# EAGLE design atmega32U4 (EAGLE 6.4)
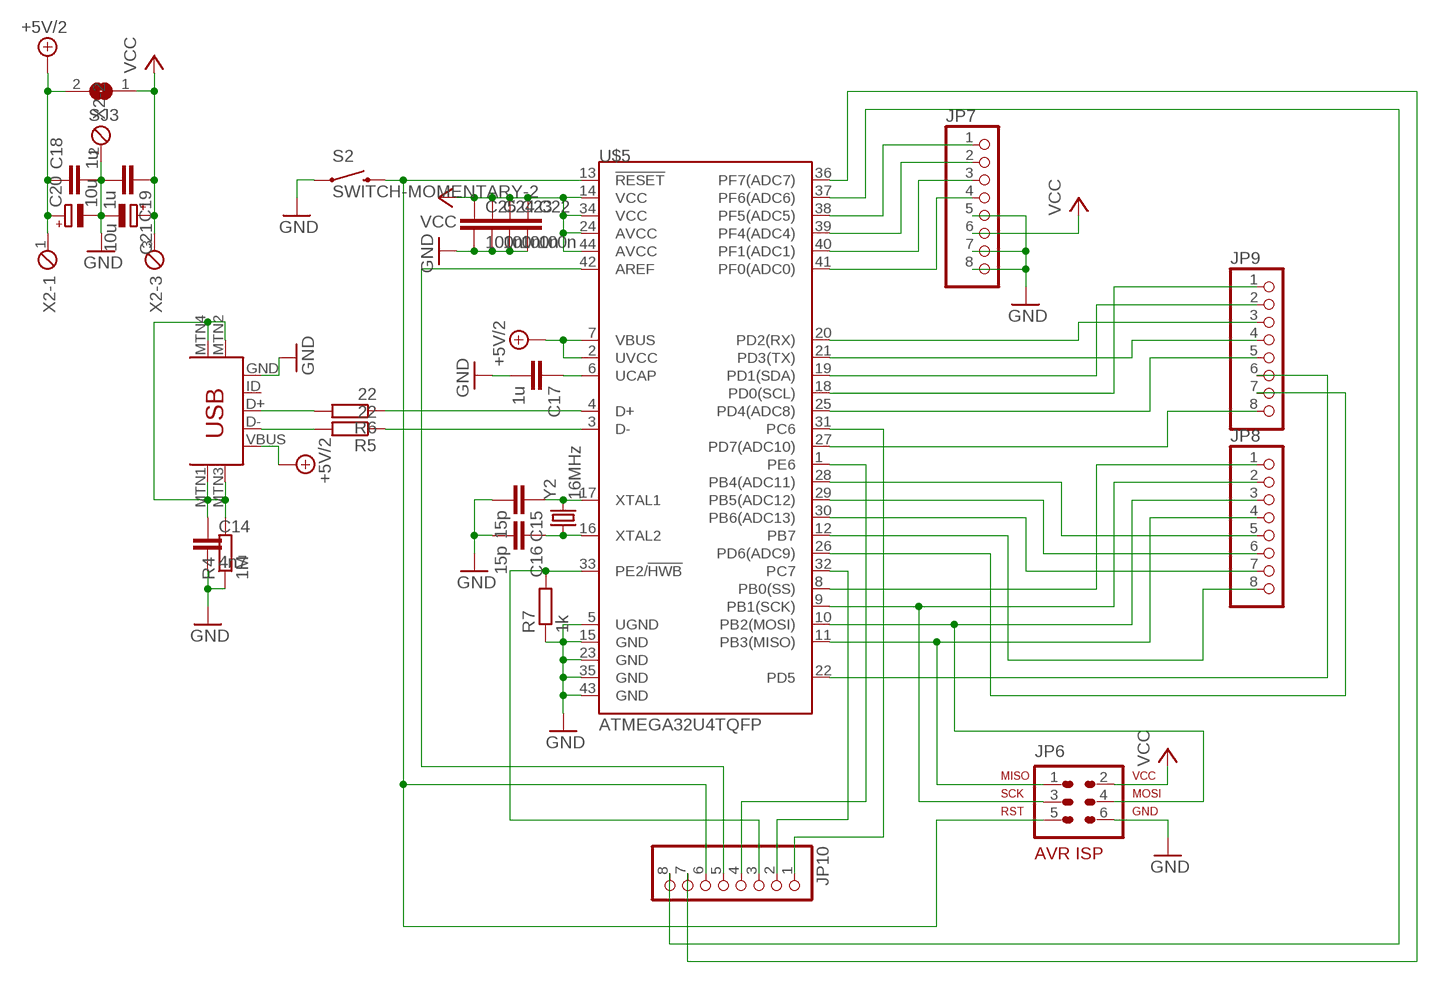
[diagram p0: schematic, sheet 1]

## Parts
C14  4n7  C-EUC0603  [C0603]
C15  15p  C-EUC0603  [C0603]
C16  15p  C-EUC0603  [C0603]
C17  1u  C-EUC0603  [C0603]
C18  1u  C-EUC0805  [C0805]
C19  1u  C-EUC0805  [C0805]
C20  10u  CPOL-EUSMCB  [SMC_B]
C21  10u  CPOL-EUSMCB  [SMC_B]
C22  100n  C-EUC0603  [C0603]
C23  100n  C-EUC0603  [C0603]
C24  100n  C-EUC0603  [C0603]
C25  100n  C-EUC0603  [C0603]
JP6  AVR-ISP-6VERT  [AVR-ISP-6]
JP7  PINHD_FIXEDPAD_ROUND-1X8  [1X08_ROUND]
JP8  PINHD_FIXEDPAD_ROUND-1X8  [1X08_ROUND]
JP9  PINHD_FIXEDPAD_ROUND-1X8  [1X08_ROUND]
JP10  PINHD_FIXEDPAD_ROUND-1X8  [1X08_ROUND]
R4  1M  R-EU_R0603  [R0603]
R5  22  R-EU_R0603  [R0603]
R6  22  R-EU_R0603  [R0603]
R7  1k  R-EU_R0603  [R0603]
S2  SWITCH-MOMENTARY-2  [TACTILE_SWITCH_TALL]
SJ3  SJ_SMALL  [SJ_2S-NO]
U$3  USB-MINIB-5PIN  [USB-MINIB]
U$5  ATMEGA32U4TQFP  [TQFP44]
X2  MPT3  [3POL254]
Y2  16MHz  CRYSTAL5X3  [CRYSTAL-SMD-5X3]

## Nets
+5V/2: C18.1 C20.+ SJ3.2 U$3.VBUS U$5.2(UVCC) U$5.7(VBUS) X2.1
AREF: JP10.5 U$5.42(AREF)
B0: JP8.1 U$5.8(PB0(SS))
B1: JP6.3 JP8.2 U$5.9(PB1(SCK))
B2: JP6.4 JP8.3 U$5.10(PB2(MOSI))
B3: JP6.1 JP8.4 U$5.11(PB3(MISO))
B4: JP8.5 U$5.28(PB4(ADC11))
B5: JP8.6 U$5.29(PB5(ADC12))
B6: JP8.7 U$5.30(PB6(ADC13))
B7: JP8.8 U$5.12(PB7)
C6: JP10.1 U$5.31(PC6)
C7: JP10.2 U$5.32(PC7)
D0: JP9.1 U$5.18(PD0(SCL))
D1: JP9.2 U$5.19(PD1(SDA))
D2: JP9.3 U$5.20(PD2(RX))
D3: JP9.4 U$5.21(PD3(TX))
D4: JP9.5 U$5.25(PD4(ADC8))
D5: JP9.6 U$5.22(PD5)
D6: JP9.7 U$5.26(PD6(ADC9))
D7: JP9.8 U$5.27(PD7(ADC10))
E2: JP10.3 R7.2 U$5.33(PE2/!HWB)
E6: JP10.4 U$5.1(PE6)
F0: JP7.4 U$5.41(PF0(ADC0))
F1: JP7.3 U$5.40(PF1(ADC1))
F4: JP7.2 U$5.39(PF4(ADC4))
F5: JP7.1 U$5.38(PF5(ADC5))
F6: JP10.8 U$5.37(PF6(ADC6))
F7: JP10.7 U$5.36(PF7(ADC7))
GND: C14.2 C15.2 C16.2 C17.2 C18.2 C19.2 C20.- C21.- C22.2 C23.2 C24.2 C25.2 JP6.6 JP7.5 JP7.7 JP7.8 R4.1 R7.1 S2.A2 U$3.GND U$5.5(UGND) U$5.15(GND) U$5.23(GND) U$5.35(GND) U$5.43(GND) X2.2
MTN1: C14.1 R4.2 U$3.MTN1(MTN2) U$3.MTN2(MTN3) U$3.MTN3(MTN1) U$3.MTN4
N$41: R6.2 U$3.D+
N$43: R5.2 U$3.D-
N$44: C15.1 U$5.17(XTAL1) Y2.3
N$45: C16.1 U$5.16(XTAL2) Y2.1
N$46: R6.1 U$5.4(D+)
N$47: R5.1 U$5.3(D-)
N$74: C17.1 U$5.6(UCAP)
RST: JP6.5 JP10.6 S2.B2 U$5.13(!RESET)
VCC: C19.1 C21.+ C22.1 C23.1 C24.1 C25.1 JP6.2 JP7.6 SJ3.1 U$5.14(VCC) U$5.24(AVCC) U$5.34(VCC) U$5.44(AVCC) X2.3
Unconnected: U$3.ID

## Library data of the parts
C14-C19 C22-C25 = rcl:C-EU: CAPACITOR, European symbol
C20 C21 = rcl:CPOL-EU: POLARIZED CAPACITOR, European symbol
JP6 = avr-7:AVR-ISP-6: AVR ISP-6 Serial Programming Header
JP7-JP10 = hsa:PINHD_FIXEDPAD_ROUND-1X8: PIN HEADER
R4-R7 = rcl:R-EU_: RESISTOR, European symbol
S2 = SparkFun:SWITCH-MOMENTARY-2
SJ3 = hsa:SJ_SMALL: SMD solder JUMPER
U$3 = SparkFun:USB-MINIB: Mini-USB "B" connector with 5th pin broken out. Created new symbol breaking out 5th "ID" pin in mini/micro USB connector spec. See: http://en.wikipedia.org/wiki/Mini_usb#Cables. Uses same footprint as 4-pin symbol. Also added pins to connect to mounting / shield pads if required (probably not generally needed as signals aren't shielded once they leave the connector).
U$5 = hsa:ATMEGA32U4
X2 = con-phoenix-254:MPT3: PHOENIX CONNECTOR; OC_FARNELL: unknown; OC_NEWARK: unknown
Y2 = SparkFun:CRYSTAL: Crystals Various standard crystals. Proven footprints. Spark Fun Electronics SKU : COM-00534

## Board
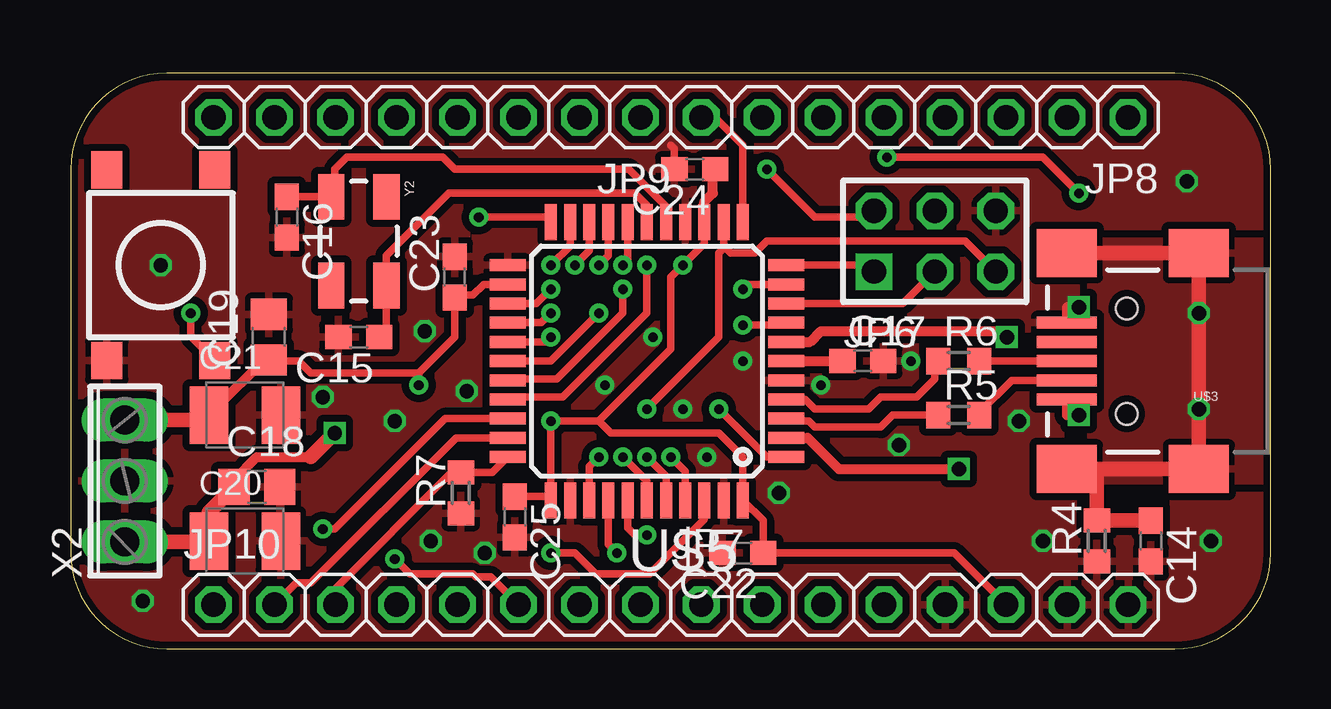
[diagram p1: board, top side]
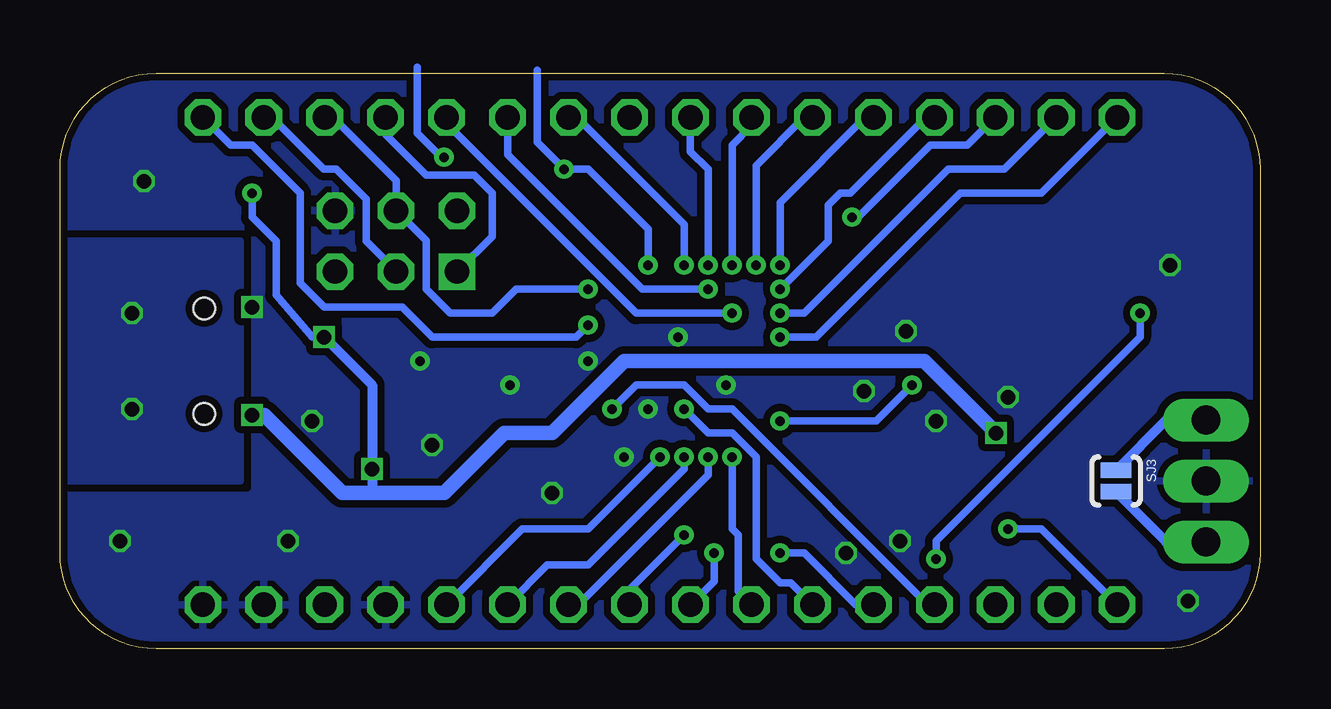
[diagram p2: board, bottom side, seen from below]

Size 50 x 24 mm. Coordinates in mm from the lower left corner, seen from the top.
Outline: 0,20 0,4 arc90 4,0 46,0 arc90 50,4 50,20 arc90 46,24 4,24 arc90 0,20
Copper layers (1*16): Top 0.035mm / dielectric 1.5mm / Bottom 0.035mm
Design rules "default": minimum track width 6mil, minimum drill 12mil, track to track 6mil, track to pad 6mil, pad to pad 6mil, via to via 6mil, smd to smd 0mil, copper to edge 10mil, drill to drill 10mil, minimum pad ring 10mil, minimum via ring 6mil, stop-mask expansion 2mil, vias tented up to drill 100mil, thermal gap 10mil

### Footprints (pad centres in the part's own frame; a part is rotated, then mirrored left to right if it is on the bottom)
C0603 = smd 1.1 x 1: 1 -0.85,0; 2 0.85,0
C0805 = smd 1.3 x 1.5: 1 -0.95,0; 2 0.95,0
SMC_B = smd 1.6 x 2.4: + -1.5,0; - 1.5,0
AVR-ISP-6 = drill 1.016 square: 1 -2.54,-1.27 | drill 1.016 octagon: 2 -2.54,1.27; 3 0,-1.27; 4 0,1.27; 5 2.54,-1.27; 6 2.54,1.27
1X08_ROUND = drill 1.016 pad 1.524 octagon: 1 -8.89,0; 2 -6.35,0; 3 -3.81,0; 4 -1.27,0; 5 1.27,0; 6 3.81,0; 7 6.35,0; 8 8.89,0
R0603 = smd 1 x 1.1: 1 -0.85,0; 2 0.85,0
TACTILE_SWITCH_TALL = smd 1.55 x 1.3: A1 -3.975,-2.25; A2 3.975,-2.25; B1 -3.975,2.25; B2 3.975,2.25
SJ_2S-NO = smd 0.635 x 1.27: 1 -0.45,0; 2 0.45,0
USB-MINIB = smd 2.5 x 0.5: D+ 2.5,0; D- 2.5,0.8; GND 2.5,-1.6; ID 2.5,-0.8; VBUS 2.5,1.6 | smd 2.5 x 2: MTN1 -3,4.5; MTN2 2.5,4.5; MTN3 -3,-4.5; MTN4 2.5,-4.5 | hole 0.9: 0,2.2; 0,-2.2
TQFP44 = smd 1.5 x 0.5: 1 -5.8,4; 2 -5.8,3.2; 3 -5.8,2.4; 4 -5.8,1.6; 5 -5.8,0.8; 6 -5.8,0; 7 -5.8,-0.8; 8 -5.8,-1.6; 9 -5.8,-2.4; 10 -5.8,-3.2; 11 -5.8,-4; 23 5.8,-4; 24 5.8,-3.2; 25 5.8,-2.4; 26 5.8,-1.6; 27 5.8,-0.8; 28 5.8,0; 29 5.8,0.8; 30 5.8,1.6; 31 5.8,2.4; 32 5.8,3.2; 33 5.8,4 | smd 0.5 x 1.5: 12 -4,-5.8; 13 -3.2,-5.8; 14 -2.4,-5.8; 15 -1.6,-5.8; 16 -0.8,-5.8; 17 0,-5.8; 18 0.8,-5.8; 19 1.6,-5.8; 20 2.4,-5.8; 21 3.2,-5.8; 22 4,-5.8; 34 4,5.8; 35 3.2,5.8; 36 2.4,5.8; 37 1.6,5.8; 38 0.8,5.8; 39 0,5.8; 40 -0.8,5.8; 41 -1.6,5.8; 42 -2.4,5.8; 43 -3.2,5.8; 44 -4,5.8
3POL254 = drill 1.2 long: 1 -2.54,0; 2 0,0; 3 2.54,0
CRYSTAL-SMD-5X3 = smd 1.9 x 1.1: 1 -1.85,-1.15; 2 1.85,-1.15; 3 1.85,1.15; 4 -1.85,1.15

### Placement (x,y rotation side)
C14  45,4.5 270 top
C15  12,13 180 top
C16  9,18 270 top
C17  33,12 0 top
C18  7.75,6.75 0 top
C19  8.25,13 90 top
C20  7.25,4.5 0 top
C21  7.25,9.75 0 top
C22  28,4 180 top
C23  16,15.5 90 top
C24  26,20 180 top
C25  18.5,5.5 270 top
JP6  36,17 0 top
JP7  35.16,1.84 0 top
JP8  35.16,22.16 180 top
JP9  14.84,22.16 180 top
JP10  14.84,1.84 0 top
R4  42.75,4.5 90 top
R5  37,9.75 0 top
R6  37,12 0 top
R7  16.25,6.5 90 top
S2  3.75,16 270 top
SJ3  6,7 270 bottom
U$3  44,12 180 top
U$5  24,12 180 top
X2  2.25,7 90 top
Y2  12,17 270 top

### Tracks (layer width: path | path; a pad name or v marks a point on that pad's centre or on a via)
+5V/2  (via drill 0.4 pad 0.8, 0.6)
  Top 0.305: v34,20.5 40.5,20.5 v42,19
  Top 0.406: 10,8 7.75,8 6.8,7.05 | U$5.2 30.7,8.8 32,7.5 v37,7.5 | U$5.7 30.8,12.8 31.25,13.25 38.75,13.25 v39,13 | U$3.VBUS 41.5,9.75 v42,9.75
  Top 0.61: X2.1 5.46,4.46 C20.+ 5.75,5.7 C18.1 6.8,7.05 | 10,8 v11,9
  Bottom 0.305: 35.12,24.25 35.12,21.5 34.12,20.5 v34,20.5 | v42,19 42,18 41,17 41,14.75 39.5,13 v39,13
  Bottom 0.406: SJ3.2 3.91,4.46 X2.1 | v39,13 37,11 v37,7.5 37,6.5
  Bottom 0.61: v11,9 14,12 26.5,12 29.5,9 31.5,9 34,6.5 37,6.5 38.25,6.5 41.5,9.75 v42,9.75
AREF  (via drill 0.4 pad 0.8)
  Top 0.305: U$5.42 26.4,5.4 24.12,3.12 21.88,3.12 21,4 v20,4
  Bottom 0.305: JP10.5 16.84,1.84 19,4 v20,4
B0  (via drill 0.4 pad 0.8)
  Top 0.305: U$5.8 29.7,13.5 v28,13.5
  Bottom 0.305: v28,13.5 28.5,13 34.5,13 35.75,14.25 39,14.25 40,15.25 40,19 42,21 42.89,21 JP8.1
B1
  Top 0.305: U$5.9 34.67,14.4 JP6.3
  Bottom 0.305: JP6.3 36,15.75 37.25,17 37.25,18.75 38.5,20 39.01,20 41.17,22.16 JP8.2
B2  (via drill 0.4 pad 0.8)
  Top 0.305: U$5.10 28.2,15.2 v28,15
  Bottom 0.305: v28,15 31,15 32,14 33.75,14 34.75,15 34.75,17.02 JP6.4 36,19.53 38.63,22.16 JP8.3
B3
  Top 0.305: U$5.11 33.19,16 JP6.1
  Bottom 0.305: JP8.4 36.43,21.43 34.75,19.75 32.75,19.75 32,19 32,17.19 JP6.1
B4  (via drill 0.4 pad 0.8)
  Top 0.305: U$5.28 20,12 v22,14
  Bottom 0.305: v22,14 26,14 33.89,21.89 JP8.5
B5  (via drill 0.4 pad 0.8)
  Top 0.305: U$5.29 18.25,11.25 20.25,11.25 23,14 v23,15
  Bottom 0.305: v23,15 25.75,15 31.35,20.6 JP8.6
B6  (via drill 0.4 pad 0.8)
  Top 0.305: U$5.30 18.3,10.5 20.5,10.5 24,14 v24,16
  Bottom 0.305: v24,16 24,17.69 28.47,22.16 JP8.7
B7
  Top 0.305: U$5.12 28,21 26.84,22.16 JP8.8
C6  (via drill 0.4 pad 0.8)
  Top 0.305: U$5.31 15.6,9.6 11,5 v10.5,5
  Bottom 0.305: v10.5,5 9.11,5 JP10.1
C7
  Top 0.305: U$5.32 16.05,8.8 10,2.75 9.4,2.75 JP10.2
D0  (via drill 0.4 pad 0.8)
  Top 0.305: U$5.18 23.2,16.2 v23,16
  Bottom 0.305: v23,16 23,20 23.73,20.73 JP9.1
D1  (via drill 0.4 pad 0.8)
  Top 0.305: U$5.19 22.4,16.4 v22,16
  Bottom 0.305: v22,16 22,21 21.19,21.81 JP9.2
D2  (via drill 0.4 pad 0.8)
  Top 0.305: U$5.20 21.6,16.6 v21,16
  Bottom 0.305: v21,16 21,20.15 18.99,22.16 JP9.3
D3  (via drill 0.4 pad 0.8)
  Top 0.305: U$5.21 20.8,16.8 v20,16
  Bottom 0.305: v20,16 20,18.61 16.45,22.16 JP9.4
D4  (via drill 0.4 pad 0.8)
  Top 0.305: U$5.25 19.4,14.4 v20,15
  Bottom 0.305: v20,15 18,17 18,18.5 17.5,19 17.07,19 13.91,22.16 JP9.5
D5  (via drill 0.4 pad 0.8)
  Top 0.305: U$5.22 19.8,18 v17,18
  Bottom 0.305: v17,18 16.75,18 13.75,21 12.19,21 JP9.6
D6  (via drill 0.4 pad 0.8)
  Top 0.305: U$5.26 19.6,13.6 v20,14
  Bottom 0.305: v20,14 18.99,14 16.99,16.01 13,20 12,20 10.99,20 10.65,20 JP9.7
D7  (via drill 0.4 pad 0.8)
  Top 0.305: U$5.27 19.8,12.8 v20,13
  Bottom 0.305: v20,13 18.5,13 12.5,19 9.11,19 JP9.8
E2
  Top 0.305: U$5.33 17.55,7.35 R7.2 16.4,7.25 15.75,7.25 11.03,2.53 JP10.3
E6  (via drill 0.4 pad 0.8)
  Top 0.305: U$5.1 29,8 v27,10
  Bottom 0.305: v27,10 26,11 24,11 23,10 22,10 13.84,1.84 JP10.4
F0  (via drill 0.4 pad 0.8)
  Top 0.305: U$5.41 25.6,7.4 v25,8
  Bottom 0.305: v25,8 28,5 30.73,5 JP7.4
F1  (via drill 0.4 pad 0.8)
  Top 0.305: U$5.40 24.8,7.2 v24,8
  Bottom 0.305: v24,8 24,7.5 28,3.5 29.69,3.5 JP7.3
F4  (via drill 0.4 pad 0.8)
  Top 0.305: U$5.39 24,7 v23,8
  Bottom 0.305: v23,8 23,7.25 28.41,1.84 JP7.2
F5  (via drill 0.4 pad 0.8)
  Top 0.305: U$5.38 23.2,5.05 23.5,4.75 v24,4.75
  Bottom 0.305: JP7.1 26.27,2.48 v24,4.75
F6  (via drill 0.4 pad 0.8)
  Top 0.305: U$5.37 22.4,4.35 v22.75,4
  Bottom 0.305: v22.75,4 22.75,2.82 JP10.8
F7  (via drill 0.4 pad 0.8)
  Top 0.305: v22,8 21.6,7.6 U$5.36
  Bottom 0.305: v22,8 22,5 21.75,4.75 21.75,2.4 JP10.7
GND  (via drill 0.4 pad 0.8, 0.6)
  Top 0.305: C24.2 25.15,20.85 25,21
  Top 0.406: v42,14.25 41.5,14.25 U$3.GND
  other vias: 47.5,4.5 28,12 35,12 13.5,9.5 15,4.5 3.75,16 10.5,10.5 14.75,13.25 25.5,10 26.5,8 22.25,11 24.25,13 16.5,10.75 39.5,9.5 34.5,8.5 29.5,6.5 40.5,4.5 46.5,19.5 3,2 31.25,11 17.25,4
  pour Bottom (isolate 0.305, rank 2): -2,26 52,26 52,-2 -2,-2
  pour Top (isolate 0.305, rank 2): -1,25 51,25 51,-1 -1,-1
MTN1  (via drill 0.6)
  Top 0.61: U$3.MTN4 U$3.MTN3 v47,14 v47,10 U$3.MTN1 U$3.MTN2 42.75,7.5 R4.2 C14.1
  pour Top (isolate 0.305): 53,17 42.5,17 42.5,7 53,7
  pour Bottom (isolate 0.305): 54,17 42.5,17 42.5,7 54,7
N$41
  Top 0.305: U$3.D+ R6.2
N$43
  Top 0.305: U$3.D- 39.2,11.2 37.85,9.85 R5.2
N$44
  Top 0.305: U$5.17 24,18.5 23.5,19 15.75,19 13.15,16.4 Y2.3 13.15,13.3 C15.1
N$45
  Top 0.305: U$5.16 24.8,18.45 23.25,20 16,20 15.5,20.5 11.5,20.5 11,20 11,19 Y2.1 C16.1
N$46
  Top 0.305: U$5.4 30.6,10.4 31,10 33.25,10 33.75,10.5 35.25,10.5 36,11.25 36,11.85 R6.1
N$47
  Top 0.305: R5.1 34.25,9.75 33.75,9.25 31,9.25 30.75,9.5 29.9,9.5 U$5.3
N$74
  Top 0.406: U$5.6 C17.1
RST  (via drill 0.4 pad 0.8)
  Top 0.305: U$5.13 27.2,16.8 27.25,16.75 | 27.25,16.75 27.5,16.5 28.5,16.5 29,17 37.27,17 JP6.5 | v24,10 27,13 27,16.5 27.25,16.75 | S2.B2 5,13.03 v5,14 | JP10.6 17.5,3 16.88,3 16.75,3.12 14.12,3.12 v13.5,3.75
  Bottom 0.305: v5,14 5,13 13.5,4.5 v13.5,3.75 | v24,10 23,9 22,9 21,8 21,3.75 20,2.75 19.56,2.75 JP10.6 18.65,1.9
VCC  (via drill 0.4 pad 0.8)
  Top 0.305: U$5.24 17.2,15.2 16.75,14.75 15.9,14.75 | C23.1 16,13 14.5,11.5 | 14.5,11.5 10,11.5 9.5,12 8.25,12 C19.1 | JP6.2 33.19,18 31,18 v29,20 | U$5.14 26.4,16.9 v25.5,16 25,15.5 25,12.5 22,9.5 | 22,9.5 v20,9.5 U$5.34 19.9,6.35 C25.1 | v14.5,11 14.5,11.5 | 22,9.5 22.5,9 27,9 28,8 U$5.44 28.85,5.35 C22.1 36.81,4 JP7.6
  Top 0.406: U$5.14 26.4,18.65 26.75,19 26.75,19.9 C24.1 | 15.9,14.75 C23.1 | 5.8,10 6,10 8.05,12.05 C19.1
  Top 0.61: X2.3 5.46,9.54 C21.+ 5.8,10 | 8.25,11.95 C19.1
  Bottom 0.305: v25.5,16 25.5,17.5 28,20 v29,20 30.12,21.12 30.12,24.12 | v20,9.5 16,9.5 v14.5,11
  Bottom 0.406: SJ3.1 3.91,9.54 X2.3

### Text on the board
tTest: D | B | F | USB
bTest: D7 | D6 | D5 | D4 | D3 | D2 | D1 | D0 | B7 | B6 | B5 | B4 | B3 | B2 | B1 | B0 | VCC | C6 | C7 | E2 | E6 | F7 | F6 | F5 | F4 | F1 | F0 | AREF | RESET | GND | VCC | GND | GND | USB